# Altium project VoltageImitator_v1.PrjPcb
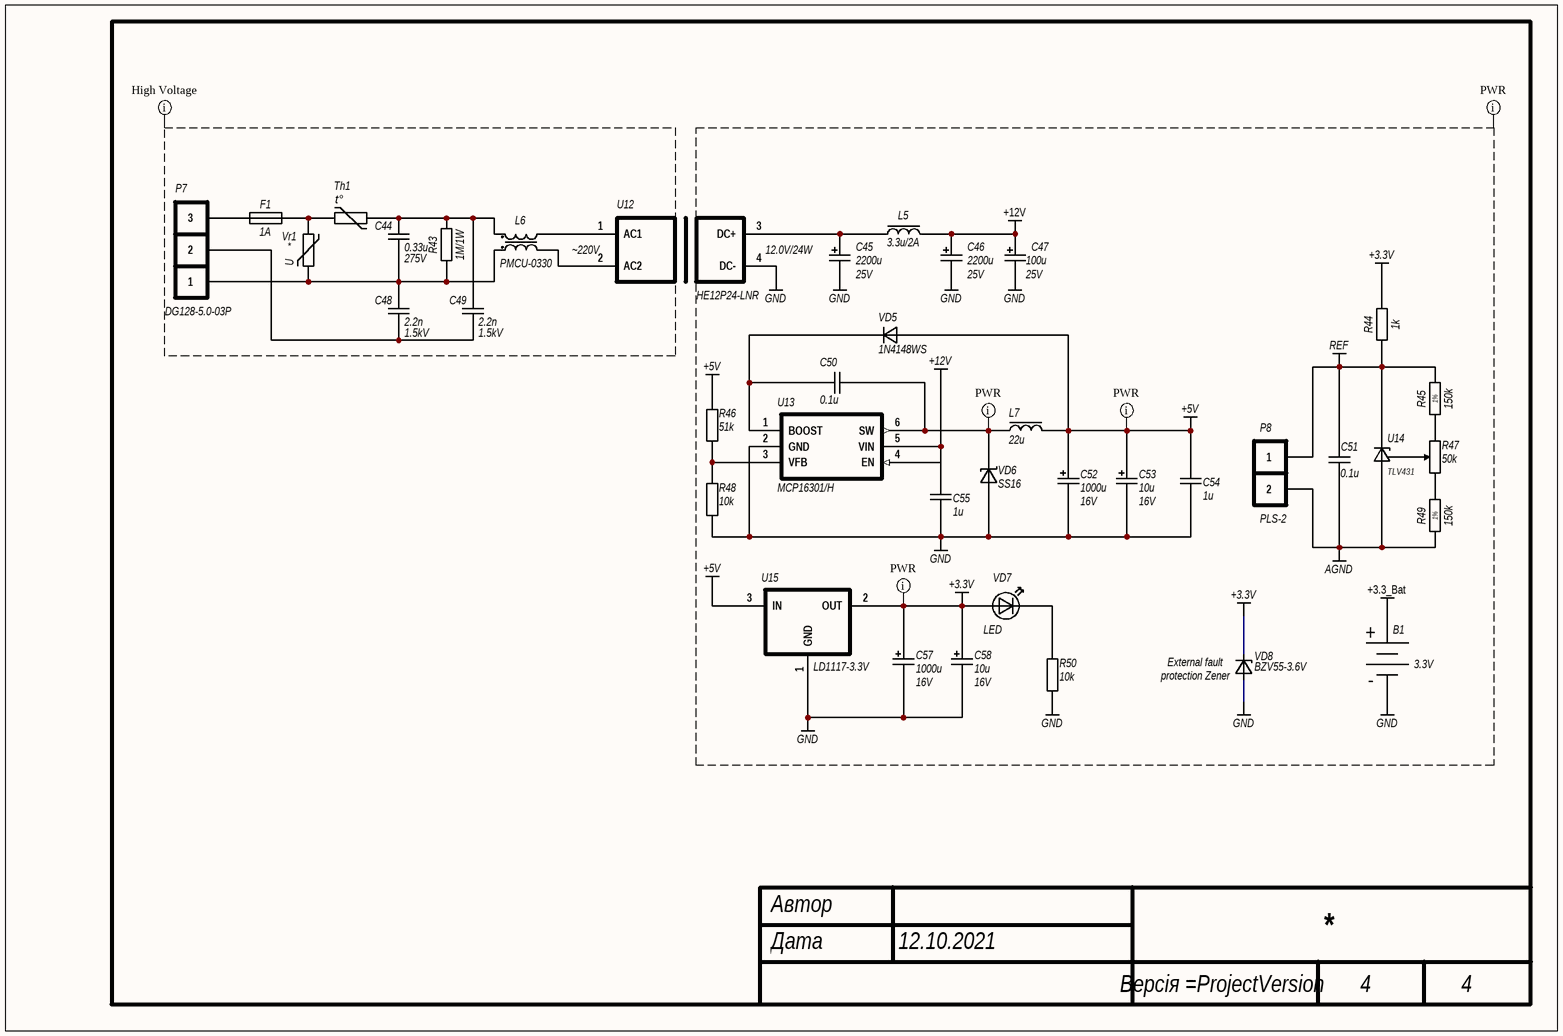
[diagram p0: Power.SchDoc]
ProjectAuthor: Tymokhin Oleksander; ProjectCompanyName: Igor Sikorsky Kyiv Polytechnic Institute; ProjectTitle: Voltage Imitator; ProjectVersion: 1.0
1 sheet, 39 parts. Net scope: global (net labels, ports and power ports of the same name join across sheets).
Board file: Board.PcbDoc

## Sheet Power.SchDoc
size A4; Date: 12.10.2021; Author: Tymokhin Oleksander; CompanyName: Igor Sikorsky Kyiv Polytechnic Institute; SheetNumber: 4; SheetTotal: 4; Title1: Voltage Imitator; Title2: - Element supply; Version: 1.0

### Parts
B1  3.3V  [BH810]
C44  0.33u  Voltage: 275V  [MER 13x5.5 h10 R10.16]
C45  2200u  Voltage: 25V  [El-d13-h25-F5-0.6]
C46  2200u  Voltage: 25V  [El-d13-h25-F5-0.6]
C47  100u  Voltage: 25V  [EL Case A (3216-18)]
C48  2.2n  Voltage: 1.5kV  [MER 13x5.5 h10 R10.16]
C49  2.2n  Voltage: 1.5kV  [MER 13x5.5 h10 R10.16]
C50  0.1u  [C0603(1608)]
C51  0.1u  [C0603(1608)]
C52  1000u  Voltage: 16V  [El-d10-h16-F5-0.6]
C53  10u  Voltage: 16V  [EL Case A (3216-18)]
C54  1u  [C0603(1608)]
C55  1u  [C0603(1608)]
C57  1000u  Voltage: 16V  [El-d10-h16-F5-0.6]
C58  10u  Voltage: 16V  [EL Case A (3216-18)]
F1  1A  [562 Series]
L5  3.3u/2A  [DR-CW8A]
L6  PMCU-0330  [PMCU-0330]
L7  22u  [CDRH6D28]
P7  DG128-5.0-03P  [DG128-5.0-03P]
P8  PLS-2  [PLS-2]
R43  1M/1W  [RES1016-650X250]
R44  1k  [R0603]
R45  150k  Accuracy: 1%  [R0603]
R46  51k  [R0603]
R47  50k  [T910W (3296W)]
R48  10k  [R0603]
R49  150k  Accuracy: 1%  [R0603]
R50  10k  [R0603]
Th1  (no value)  [TH D13 7.5b]
U12  HE12P24-LNR  Out: 12.0V/24W  In: ~220V  [HExxPyy-LRN]
U13  MCP16301/H  [SOT23-6]
U14  TLV431  [SOT23]
U15  LD1117-3.3V  [SOT223]
VD5  1N4148WS  [SOD323]
VD6  SS16  [DO-214AC (SMA)]
VD7  LED  [SMD_0805_GREEN]
VD8  BZV55-3.6V  [SOD80C]
Vr1  *  [VAR-10K-5.6]

### Nets
+3.3_Bat: B1.1
+3.3V: C57.1 C58.1 R44.2 U15.2(OUT) VD7.1(A) VD8.2(K)
+5V: C52.1 C53.1 C54.1 L7.2 R46.2 U15.3(IN) VD5.1(A)
+12V: C46.1 C47.1 C55.1 L5.2 U13.4(EN) U13.5(VIN)
AGND: C51.1 P8.2 R49.1 U14.1(A)
GND: B1.2 C45.2 C46.2 C47.2 C52.2 C53.2 C54.2 C55.2 C57.2 C58.2 R48.1 R50.1 U12.4(DC-) U13.2(GND) U15.1(GND) VD6.1(A) VD8.1(A)
REF: C51.2 P8.1 R44.1 R45.2 U14.2(K)
NetC44_1: C44.1 C48.2 L6.2 P7.1 R43.1 Vr1.1
NetC44_2: C44.2 C49.2 L6.1 R43.2 Th1.2
NetC45_1: C45.1 L5.1 U12.3(DC+)
NetC48_1: C48.1 C49.1 P7.2
NetC50_1: C50.1 U13.1(BOOST) VD5.2(K)
NetC50_2: C50.2 L7.1 U13.6(SW) VD6.2(K)
NetF1_1: F1.1 P7.3
NetF1_2: F1.2 Th1.1 Vr1.2
NetL6_3: L6.3 U12.2(AC2)
NetL6_4: L6.4 U12.1(AC1)
NetR45_1: R45.1 R47.3
NetR46_1: R46.1 R48.2 U13.3(VFB)
NetR47_1: R47.1 R49.2
NetR47_2: R47.2 U14.3(Adj)
NetR50_2: R50.2 VD7.2(K)

### Layout directives
net class PWR: +3.3_Bat, +3.3V, +5V, +12V, AGND, GND, NetC50_2, REF
net class High Voltage: (no net found under the mark)

### Notes on the sheet
- (near VD8) External fault protection Zener
- Автор
- Дата
- (in symbol Battery Holder) +; -
- (in symbol Thermistor) t°
- (in symbol Varistor) U

### Library data of the parts
B1 = Battery Holder: Battery holder CR2032 (3.3В); Value: 3.3V
C44 C48 C49 = Capasitor: Model: *
  C44: Value: 0.33u
  C48 C49: Value: 2.2n
C45 C46 = Capasitor POL: Model: ECAP 2200/6.3V 1020 105'C; Value: 2200u
C47 = Capasitor TECAP: Model: 293D227X96R3C2TE3; Value: 100u
C50 C51 C54 C55 = Capasitor SMD
  C50: Value: 0.1u
  C51: Value: 0.1u; Model: *
  C54 C55: Value: 1u
C52 C57 = Capasitor POL: Model: ECAP 1000/16V 1016 105°C; Value: 1000u
C53 C58 = Capasitor TECAP: Model: TAJA106K016RNJ; Value: 10u
F1 = Fuse: Value: 1A; Model: *
L5 L7 = Inductor
  L5: Value: 3.3u/2A
  L7: Value: 22u
L6 = Chocke Inductor
P7 = DG128-5.0-03P: 20A/300V AC 5mm
R43 = Resistor THD: Value: 1M/1W; Model: *
R44-R46 R48-R50 = Resistor SMD: Model: *
  R44: Value: 1k; Accuracy: *
  R45 R49: Value: 150k
  R46: Value: 51k
  R48 R50: Value: 10k
R47 = Trimming Resistor: Set Position: 0.5; Value: 50k
Th1 = Thermistor
U14 = TL431: Precision Low noise Variable "Zener". Vin up to 36V, 0.2Ohm output impedance. Sink-current 1 - 100mA. Reference voltage - 2.495V; pin to pad: 1>3 2>1 3>2
U15 = LD1117: pin to pad: 2>2+4; Value: 3.3V
VD5 = 1N4148WS: SOD323 100V 200mA
VD6 = SS16: SMA (DO214AC) Schottky 60V 1A
VD8 = BZV55: SOD80C 250mA; Voltage: 3.6V
Vr1 = Varistor: Model: *
VD7 = LED: Model: *